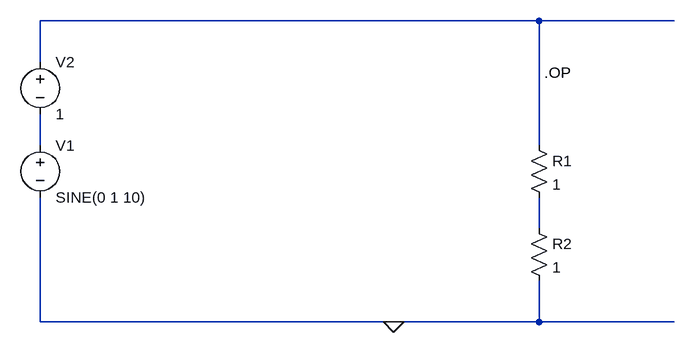
[diagram p0: schematic OP_V-Sine_V-DC_R+R.asc]
OP_V-Sine_V-DC_R+R.asc, the LTspice schematic file:
Version 4
SHEET 1 880 680
WIRE 640 64 -128 64
WIRE 848 64 640 64
WIRE -128 128 -128 64
WIRE -128 256 -128 208
WIRE 640 256 640 64
WIRE 640 384 640 336
WIRE -128 528 -128 336
WIRE 416 528 -128 528
WIRE 640 528 640 464
WIRE 640 528 416 528
WIRE 848 528 640 528
FLAG 416 528 0
SYMBOL voltage -128 240 R0
SYMATTR InstName V1
SYMATTR Value SINE(0 1 10)
SYMBOL res 624 240 R0
SYMATTR InstName R1
SYMATTR Value 1
SYMBOL voltage -128 112 R0
SYMATTR InstName V2
SYMATTR Value 1
SYMBOL res 624 368 R0
SYMATTR InstName R2
SYMATTR Value 1
TEXT 648 144 Left 2 !.OP

The netlist it stands for:
* OP_V-Sine_V-DC_R+R.asc
V1 N002 0 SINE(0 1 10)
R1 N001 N003 1
V2 N001 N002 1
R2 N003 0 1
.OP
.backanno
.end